# EAGLE schematic miniprojectlevel1 (EAGLE 7.2.0)
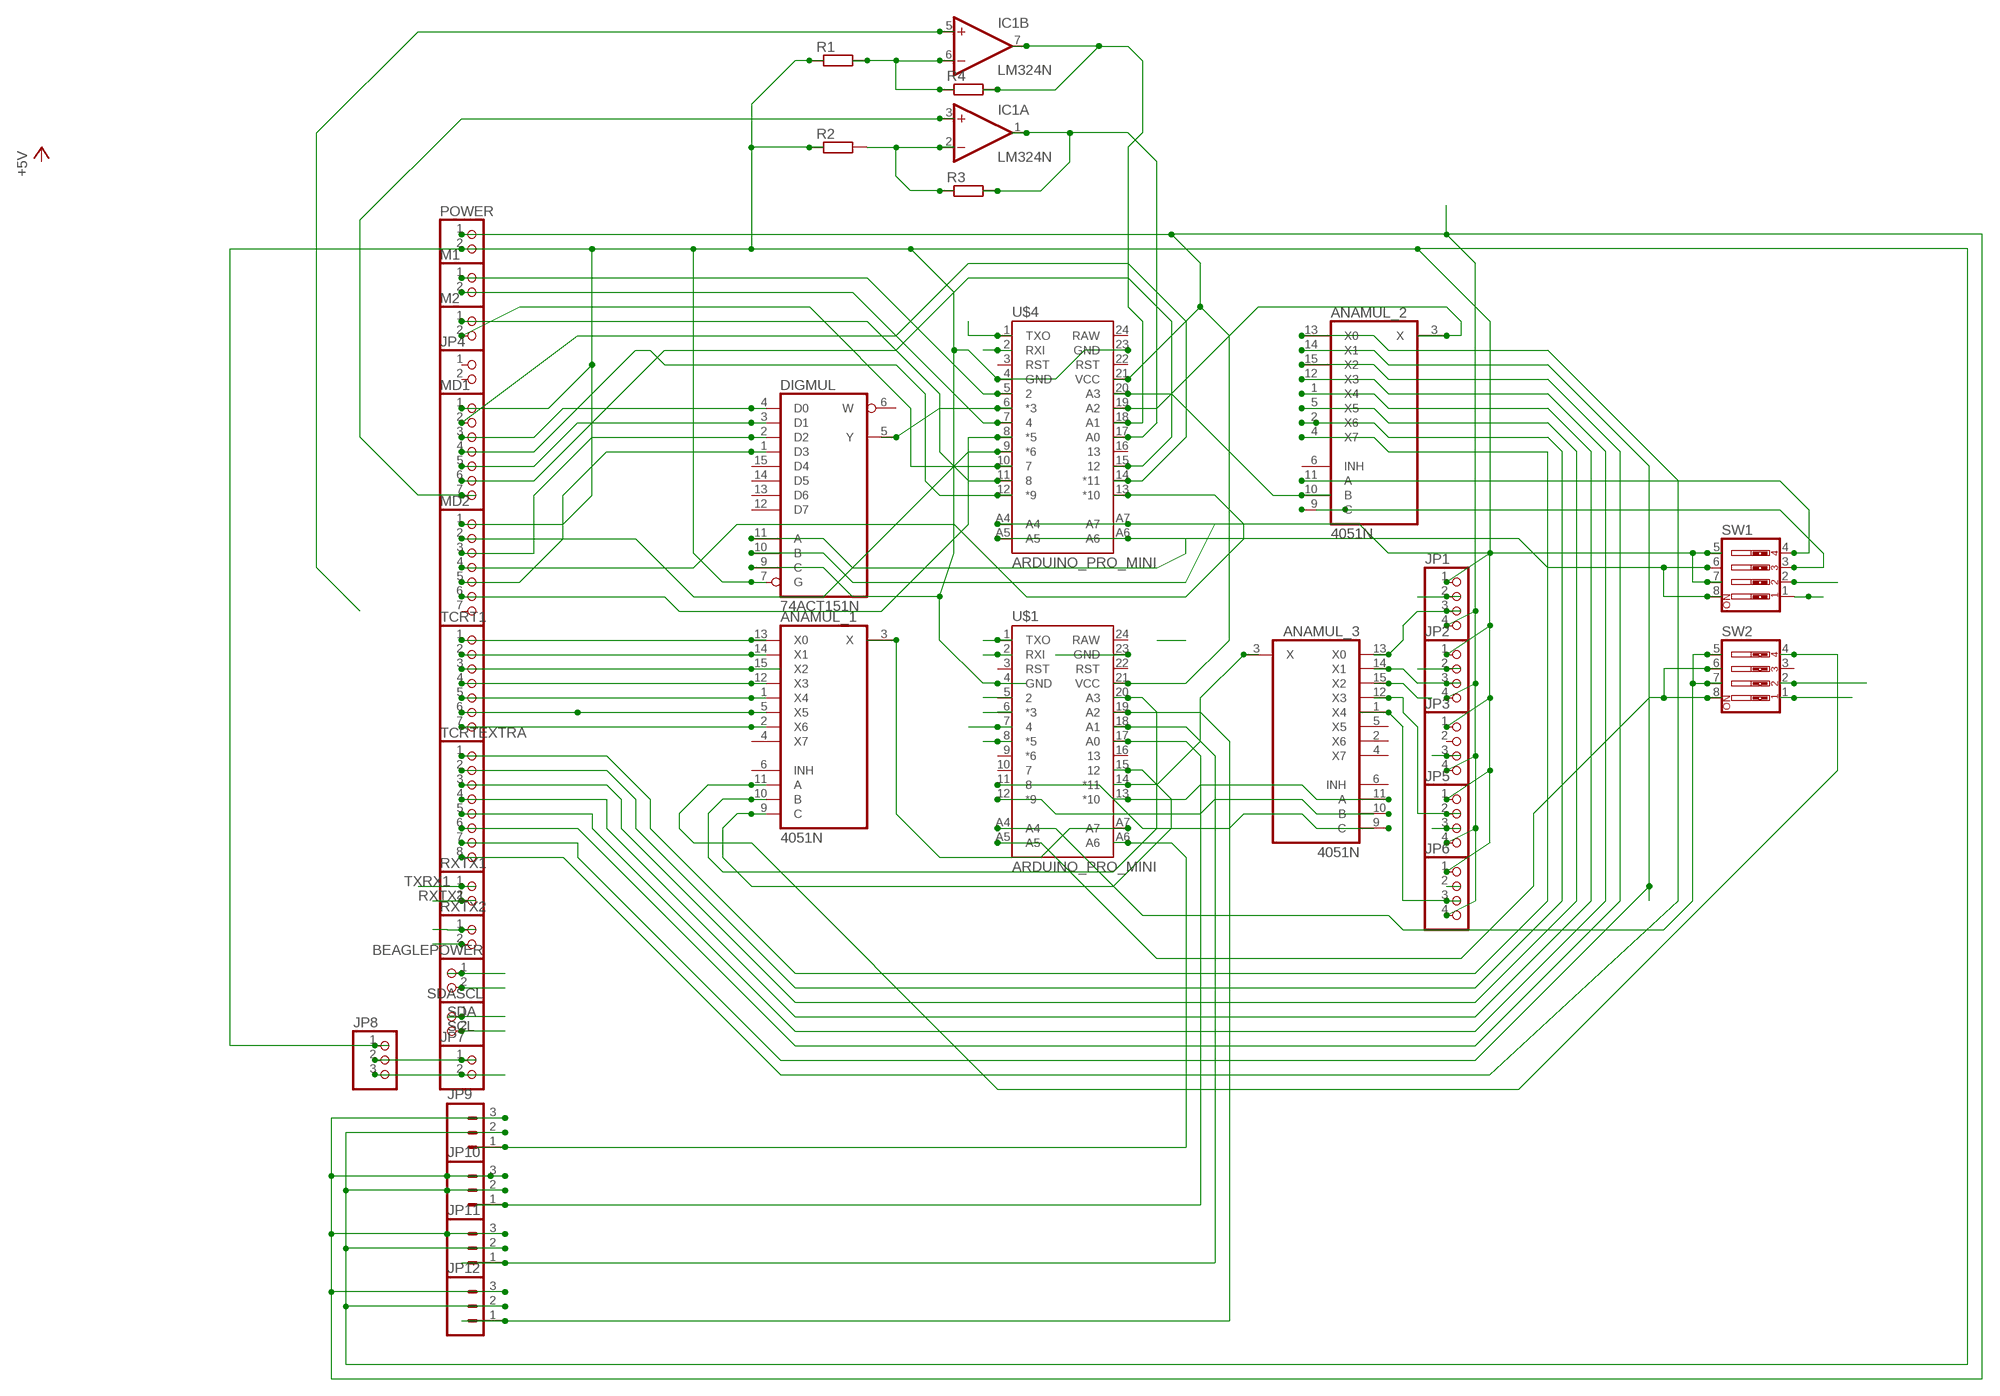
[diagram p0: schematic, sheet 1]

## Parts
ANAMUL_1  4051N  [DIL16]
ANAMUL_2  4051N  [DIL16]
ANAMUL_3  4051N  [DIL16]
BEAGLEPOWER  PINHD-1X2  [1X02]
DIGMUL  74ACT151N  [DIL16]
IC1  LM324N  [DIL14]
JP1  PINHD-1X4  [1X04]
JP2  PINHD-1X4  [1X04]
JP3  PINHD-1X4  [1X04]
JP4  PINHD-1X2  [1X02]
JP5  PINHD-1X4  [1X04]
JP6  PINHD-1X4  [1X04]
JP7  PINHD-1X2  [1X02]
JP8  PINHD-1X3  [1X03]
JP9  M03JST-PTH-VERT  [JST-3-PTH-VERT]
JP10  M03JST-PTH-VERT  [JST-3-PTH-VERT]
JP11  M03JST-PTH-VERT  [JST-3-PTH-VERT]
JP12  M03JST-PTH-VERT  [JST-3-PTH-VERT]
M1  PINHD-1X2  [1X02]
M2  PINHD-1X2  [1X02]
MD1  PINHD-1X7  [1X07]
MD2  PINHD-1X7  [1X07]
POWER  PINHD-1X2  [1X02]
R1  R0207/10  [0207/10]
R2  R0207/10  [0207/10]
R3  R0207/10  [0207/10]
R4  R0207/10  [0207/10]
RXTX1  PINHD-1X2  [1X02]
RXTX2  PINHD-1X2  [1X02]
SDASCL  PINHD-1X2  [1X02]
SW1  SW_DIP-4  [EDG-04]
SW2  SW_DIP-4  [EDG-04]
TCRT1  PINHD-1X7  [1X07]
TCRTEXTRA  PINHD-1X8  [1X08]
U$1  ARDUINO_PRO_MINI  [ARDUINO_PRO_MINI]
U$4  ARDUINO_PRO_MINI  [ARDUINO_PRO_MINI]

## Nets
N$1: DIGMUL.5(Y) U$4.6(*3)
N$2: ANAMUL_3.11(A)
N$3: ANAMUL_1.1(X4) TCRT1.5
N$4: ANAMUL_1.13(X0) TCRT1.1
N$5: ANAMUL_1.14(X1) TCRT1.2
N$6: ANAMUL_1.15(X2) TCRT1.3
N$7: ANAMUL_1.12(X3) TCRT1.4
N$8: ANAMUL_1.5(X5) TCRT1.6
N$9: ANAMUL_1.2(X6) TCRT1.7
N$10: DIGMUL.2(D2) MD2.3
N$11: M2.1 U$4.11
N$12: DIGMUL.4(D0) MD1.3
N$13: DIGMUL.3(D1) MD1.5
N$14: DIGMUL.11(A) U$4.A6
N$15: DIGMUL.10(B) U$4.A7
N$16: DIGMUL.7(G) DIGMUL.9(C) JP2.1 JP3.1 JP5.1 JP6.1 JP9.2 JP10.2 JP11.2 JP12.2 MD1.1 MD2.1 R1.1 R2.1 U$1.4(GND) U$4.4(GND) U$4.23(GND)
N$17: MD1.4 U$4.12(*9)
N$18: DIGMUL.1(D3) MD2.5
N$19: MD1.2 U$4.14(*11)
N$20: MD1.6 U$4.15
N$21: MD2.2 U$4.9(*6)
N$22: MD2.6 U$4.8(*5)
N$23: MD2.4 U$4.13(*10)
N$24: ANAMUL_2.13(X0) TCRTEXTRA.8
N$25: IC1.5(B:+IN)
N$26: M1.1 U$4.5
N$27: M1.2 U$4.7
N$28: M2.2 U$4.10
N$29: ANAMUL_2.11(A) SW1.4
N$30: ANAMUL_2.10(B) U$4.20(A3)
N$31: SW1.3
N$32: ANAMUL_2.3(X) U$4.19(A2)
N$33: ANAMUL_3.13(X0) JP1.3
N$34: ANAMUL_3.14(X1) JP2.3
N$35: SW1.5 SW1.7 U$4.A4
N$36: U$1.23(GND)
N$37: ANAMUL_3.15(X2)
N$38: IC1.6(B:-IN) R1.2 R4.1
N$39: ANAMUL_1.11(A) SW2.4
N$40: ANAMUL_1.10(B) U$1.20(A3)
N$41: ANAMUL_1.9(C) U$1.15
N$42: ANAMUL_1.3(X) U$1.A7
N$43: U$1.13(*10)
N$44: U$1.12(*9)
N$46: U$1.11
N$47: JP1.2
N$48: ANAMUL_3.3(X) U$1.14(*11)
N$49: JP2.2
N$51: JP6.2
N$53: ANAMUL_3.12(X3)
N$54: ANAMUL_3.1(X4) JP6.3
N$55: IC1.3(A:+IN) MD1.7
N$56: IC1.2(A:-IN) R2.2 R3.1
N$57: ANAMUL_2.14(X1) TCRTEXTRA.7
N$58: ANAMUL_2.15(X2) TCRTEXTRA.6
N$59: IC1.7(B:OUT) R4.2 U$4.18(A1)
N$60: IC1.1(A:OUT) R3.2 U$4.17(A0)
N$61: ANAMUL_2.12(X3) TCRTEXTRA.5
N$62: ANAMUL_2.1(X4) TCRTEXTRA.4
N$63: ANAMUL_2.5(X5) TCRTEXTRA.3
N$64: ANAMUL_2.2(X6) TCRTEXTRA.2
N$65: ANAMUL_2.4(X7) TCRTEXTRA.1
N$68: BEAGLEPOWER.1
N$71: JP3.3
N$72: JP5.3
N$73: SW2.6 SW2.8 U$1.A5
N$74: SW2.5 SW2.7 U$1.A4
N$75: BEAGLEPOWER.2
N$76: SW1.6 SW1.8 U$4.A5
N$77: ANAMUL_3.10(B)
N$78: ANAMUL_3.9(C)
N$79: JP12.1 U$1.19(A2)
N$80: JP11.1 U$1.18(A1)
N$81: JP10.1 U$1.17(A0)
N$82: JP9.1 U$1.A6
N$84: ANAMUL_2.9(C)
N$85: JP1.1
N$86: JP5.2
N$87: U$1.7
N$88: U$1.8(*5)
RXTX1: RXTX1.2 U$4.2(RXI)
RXTX2: RXTX2.2 U$1.2(RXI)
SCL: SDASCL.2 SW1.1 SW2.1
SDA: SDASCL.1 SW1.2 SW2.2
TXRX1: RXTX1.1 U$4.1(TXO)
TXRX2: RXTX2.1 U$1.1(TXO)
VCC: JP1.4 JP2.4 JP3.4 JP5.4 JP6.4 JP9.3 JP10.3 JP11.3 JP12.3 POWER.1 U$1.21(VCC) U$4.21(VCC)
Unconnected: ANAMUL_1.4(X7) ANAMUL_1.6(INH) ANAMUL_2.6(INH) ANAMUL_3.2(X6) ANAMUL_3.4(X7) ANAMUL_3.5(X5) ANAMUL_3.6(INH) DIGMUL.6(W) DIGMUL.12(D7) DIGMUL.13(D6) DIGMUL.14(D5) DIGMUL.15(D4) IC1.8(C:OUT) IC1.9(C:-IN) IC1.10(C:+IN) IC1.12(D:+IN) IC1.13(D:-IN) IC1.14(D:OUT) JP3.2 JP4.1 JP4.2 JP7.1 JP7.2 JP8.1 JP8.2 JP8.3 MD2.7 POWER.2 SW2.3 U$1.3(RST) U$1.5 U$1.6(*3) U$1.9(*6) U$1.10 U$1.16 U$1.22(RST) U$1.24(RAW) U$4.3(RST) U$4.16 U$4.22(RST) U$4.24(RAW)

## Power pins joined to a net without a drawn wire
GND: ANAMUL_1.8(GND) ANAMUL_2.8(GND) ANAMUL_3.8(GND) DIGMUL.8(GND)
V+: IC1.4(P:V+)
V-: IC1.11(P:V-)
VCC: ANAMUL_1.16(VCC) ANAMUL_2.16(VCC) ANAMUL_3.16(VCC) DIGMUL.16(VCC)
VEE: ANAMUL_1.7(VEE) ANAMUL_2.7(VEE) ANAMUL_3.7(VEE)

## Library data of the parts
ANAMUL_1-ANAMUL_3 = 40xx:4051: 8-channel ANALOG MULTIPLEXER
BEAGLEPOWER JP4 JP7 M1 M2 POWER RXTX1 RXTX2 SDASCL = pinhead:PINHD-1X2: PIN HEADER
DIGMUL = 74xx-eu:74*151: Data SELECTOR/MULTIPLEXER
IC1 = linear:LM324: OP AMP
JP1-JP3 JP5 JP6 = pinhead:PINHD-1X4: PIN HEADER
JP8 = pinhead:PINHD-1X3: PIN HEADER
JP9-JP12 = SparkFun-Connectors:M03: Header 3 Standard 3-pin 0.1" header. Use with straight break away headers (SKU : PRT-00116), right angle break away headers (PRT-00553), swiss pins (PRT-00743), machine pins (PRT-00117), and female headers (PRT-00115). Molex polarized connector foot print use with SKU : PRT-08232 with associated crimp pins and housings.
MD1 MD2 TCRT1 = pinhead:PINHD-1X7: PIN HEADER
R1-R4 = eagle-ltspice:R: RESISTOR, European symbol; SPICEMODEL: NONE; SPICEPREFIX: R
SW1 SW2 = special:SW_DIP-4: DIP SWITCH
TCRTEXTRA = pinhead:PINHD-1X8: PIN HEADER
U$1 U$4 = SparkFun-Boards:ARDUINO_PRO_MINI